# Altium schematic sheet vga12-wing.SchDoc: Posedge VGA-12Bit Wing
size A4; Organization: www.posedge.ir; Address1: Rayan-Sanat Tech.; Address2: Isfahan Science and; Address3: Technology Town, Isfahan; Address4: IRAN
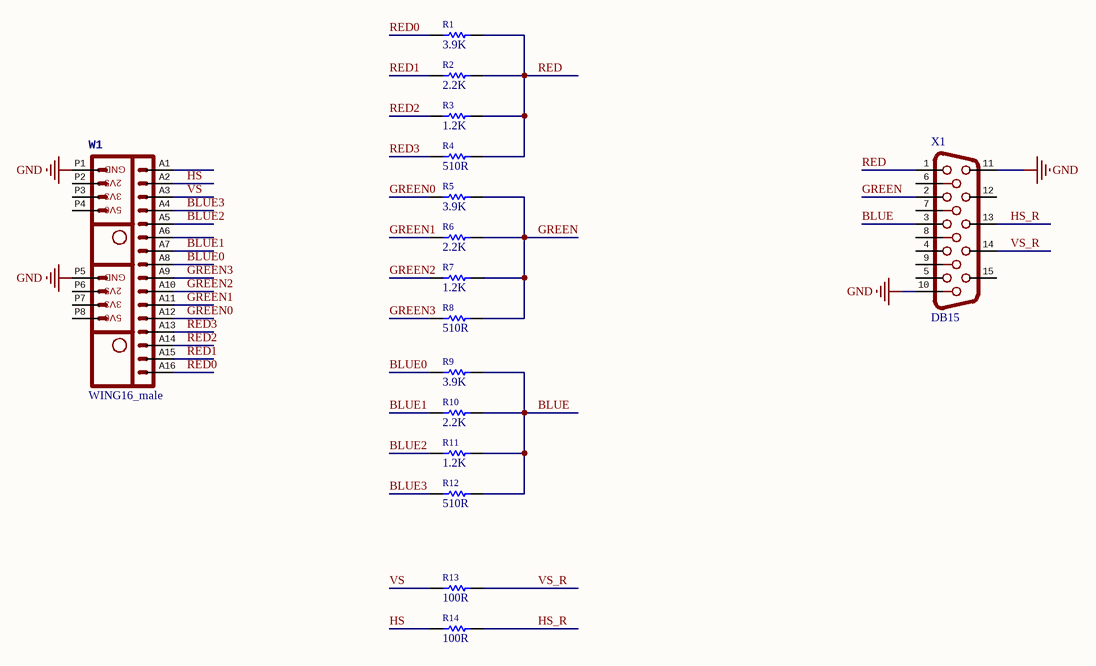
[diagram p0: vga12-wing.SchDoc]

## Parts
R1  3.9K  [R0805_M]
R2  2.2K  [R0805_M]
R3  1.2K  [R0805_M]
R4  510R  [R0805_M]
R5  3.9K  [R0805_M]
R6  2.2K  [R0805_M]
R7  1.2K  [R0805_M]
R8  510R  [R0805_M]
R9  3.9K  [R0805_M]
R10  2.2K  [R0805_M]
R11  1.2K  [R0805_M]
R12  510R  [R0805_M]
R13  100R  [R0805_M]
R14  100R  [R0805_M]
W1  WING16_male  [WINGSIDE_16BIT - male]
X1  DB15  [DB15_Female_Right_VGA]

## Nets
GND: W1.P1(GND) W1.P5(GND) X1.10 X1.11
BLUE: R9.1 R10.1 R11.1 R12.1 X1.3
BLUE0: R9.2 W1.A8
BLUE1: R10.2 W1.A7
BLUE2: R11.2 W1.A5
BLUE3: R12.2 W1.A4
GREEN: R5.1 R6.1 R7.1 R8.1 X1.2
GREEN0: R5.2 W1.A12
GREEN1: R6.2 W1.A11
GREEN2: R7.2 W1.A10
GREEN3: R8.2 W1.A9
HS: R14.2 W1.A2
HS_R: R14.1 X1.13
RED: R1.1 R2.1 R3.1 R4.1 X1.1
RED0: R1.2 W1.A16
RED1: R2.2 W1.A15
RED2: R3.2 W1.A14
RED3: R4.2 W1.A13
VS: R13.2 W1.A3
VS_R: R13.1 X1.14

Not connected (* = marked no-connect by the designer): W1 A1 A6 P2(2V2) P3(3V3) P4(5V) P6(2V5) P7(3V3) P8(5V); X1 4 5 6 7 8 9 12 15

## Notes on the sheet
- Title
- Size:
- Date:
- A4
- Number:
- Revision:
- Sheet
- of
- (in symbol WING16_male) 5V0

## Library data of the parts
R1-R14 = R0805: Chip Resistor size 0805
  R1 R5 R9: Value: 3.9K
  R2 R6 R10: Value: 2.2K
  R3 R7 R11: Value: 1.2K
  R4 R8 R12: Value: 510R
  R13 R14: Value: 100R
W1 = WING16_male: Papilio Wing16
X1 = DB15_FEMALE_RIGHT_VGA: DB15 Female Right Angle VGA Connector; OC_FARNELL: unknown; OC_NEWARK: unknown